# Altium schematic sheet PX4FMUv2.4.6_7.SchDoc: PX4FMUv2.4.6
size 282 x 200 mm; Date: 2020/2/15 15:44:31; SheetNumber: 8; GateName_1: G$1; SymbolName_1: A4L-LOC; LibraryName: pixhawk2; DeviceSetName: A4L-LOC
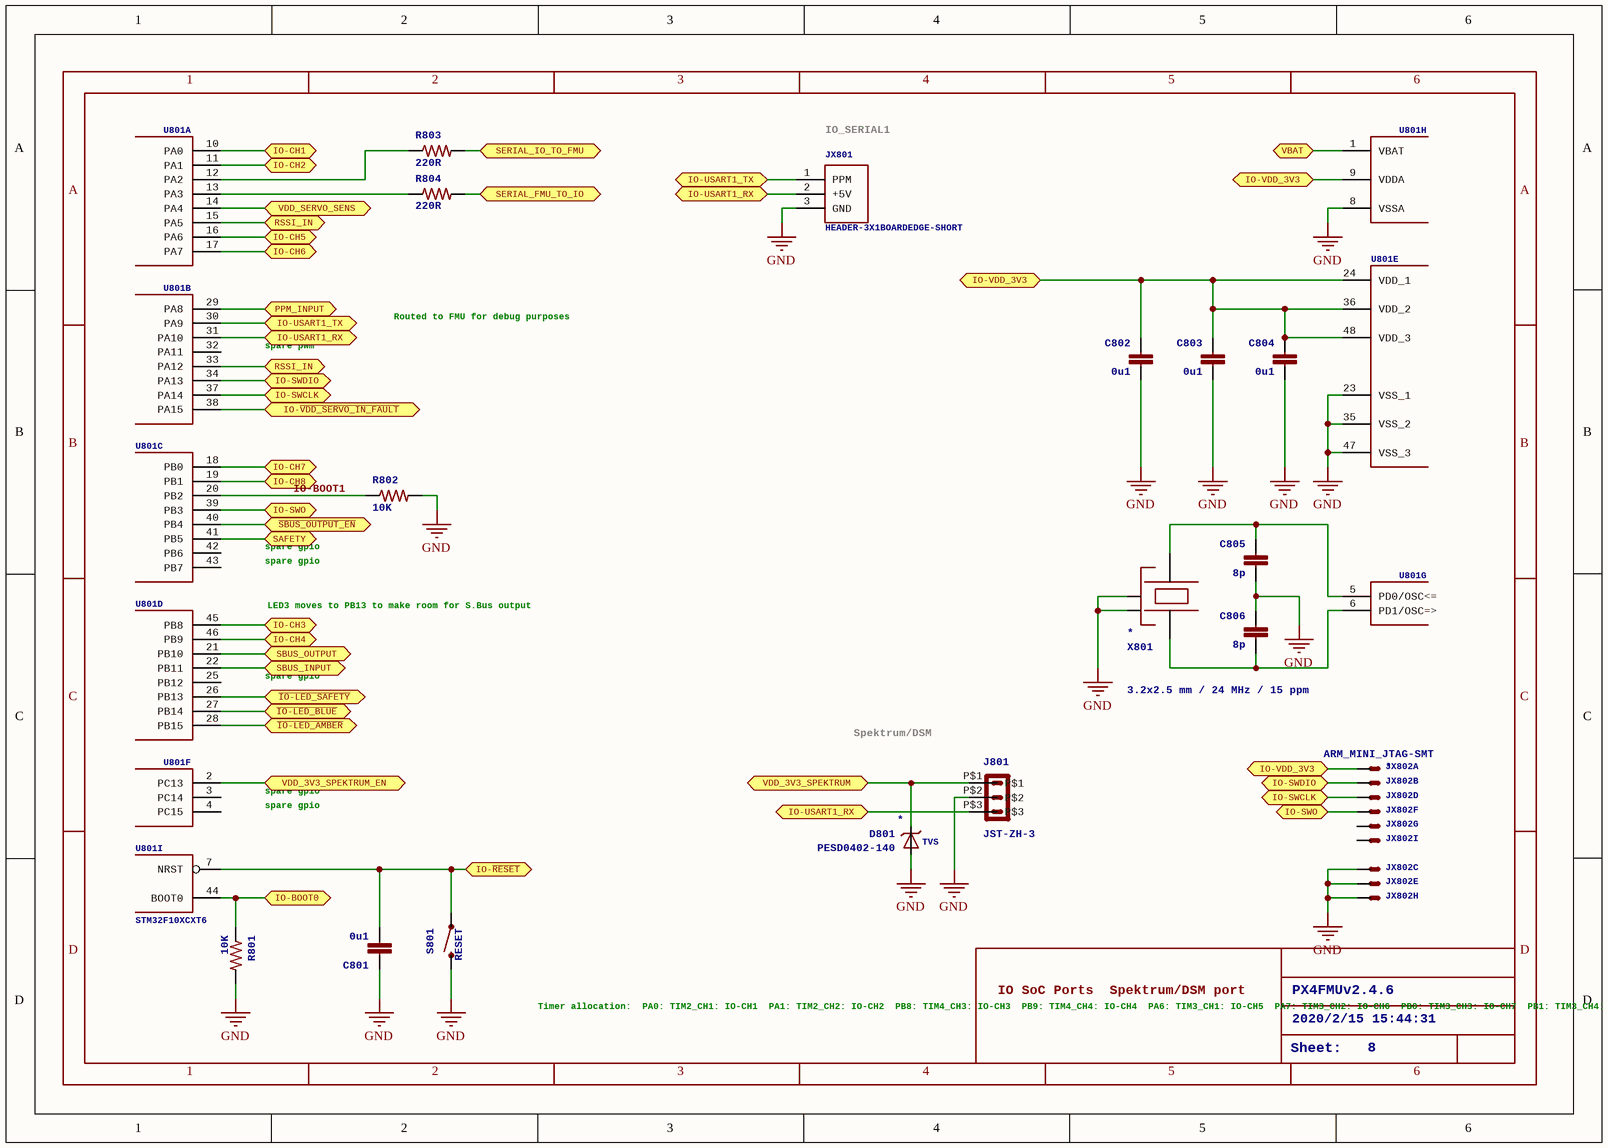
[diagram p0: PX4FMUv2.4.6_7.SchDoc]

## Parts
C801  0u1  [0402-CAP]
C802  0u1  [0402-CAP]
C803  0u1  [0402-CAP]
C804  0u1  [0402-CAP]
C805  8p  [0402-CAP]
C806  8p  [0402-CAP]
D801  PESD0402-140  [0402-TVS]
J801  JST-ZH-3  [JST-ZH-SMT-VERTICAL]
JX801  HEADER-3X1BOARDEDGE-SHORT  [HEADER_3X01_SMD_H_BOARD_EDGE_SHORT]
JX802  ARM_MINI_JTAG-SMT  [FTSH-105-01-XXX-DV-K]  (parts A,B,C,D,E,F,G,H,I of 9)
R801  10K  [0402-RES]
R802  10K  [0402-RES]
R803  220R  [0402-RES]
R804  220R  [0402-RES]
S801  RESET  [EVQP7J01K]
U801  STM32F10XCXT6  [TQFP48]  (value not drawn)  (parts A,B,C,D,E,F,G,H,I of 9)
X801  3.2x2.5 mm / 24 MHz / 15 ppm  [OSCILLATOR-3.2X2.5]

## Ports
IO-BOOT0, IO-CH1, IO-CH2, IO-CH3, IO-CH4, IO-CH5, IO-CH6, IO-CH7, IO-CH8, IO-SWCLK, IO-SWDIO, IO-SWO, IO-USART1_RX, IO-USART1_TX, IO-VDD_3V3, IO-~{RESET}, IO-~{VDD_SERVO_IN_FAULT}, PPM_INPUT, RSSI_IN, SAFETY, SBUS_INPUT, SBUS_OUTPUT, SERIAL_FMU_TO_IO, SERIAL_IO_TO_FMU, VBAT, VDD_3V3_SPEKTRUM, VDD_3V3_SPEKTRUM_EN, VDD_SERVO_SENS, ~{IO-LED_AMBER}, ~{IO-LED_BLUE}, ~{IO-LED_SAFETY}, ~{SBUS_OUTPUT_EN}

## Nets
GND: C801.P$1 C802.P$2 C803.P$2 C804.P$2 C805.P$2 C806.P$1 D801.A J801.P$2 JX801.3(GND) JX802.3(S) JX802.5(S) JX802.9(S) R801.P$2 R802.P$2 S801.B3 U801.8(VSSA) U801.23(VSS_1) U801.35(VSS_2) U801.47(VSS_3) X801.2(NC_2) X801.4(NC_4)
~{IO-LED_AMBER}: U801.28(PB15) ; port ~{IO-LED_AMBER}
~{IO-LED_BLUE}: U801.27(PB14) ; port ~{IO-LED_BLUE}
~{IO-LED_SAFETY}: U801.26(PB13) ; port ~{IO-LED_SAFETY}
IO-BOOT0: R801.P$1 U801.44(BOOT0) ; port IO-BOOT0
IO-BOOT1: R802.P$1 U801.20(PB2)
IO-CH1: U801.10(PA0) ; port IO-CH1
IO-CH2: U801.11(PA1) ; port IO-CH2
IO-CH3: U801.45(PB8) ; port IO-CH3
IO-CH4: U801.46(PB9) ; port IO-CH4
IO-CH5: U801.16(PA6) ; port IO-CH5
IO-CH6: U801.17(PA7) ; port IO-CH6
IO-CH7: U801.18(PB0) ; port IO-CH7
IO-CH8: U801.19(PB1) ; port IO-CH8
IO-~{RESET}: C801.P$2 S801.A1 U801.7(NRST) ; port IO-~{RESET}
IO-SWCLK: JX802.4(S) U801.37(PA14) ; port IO-SWCLK
IO-SWDIO: JX802.2(S) U801.34(PA13) ; port IO-SWDIO
IO-SWO: JX802.6(S) U801.39(PB3) ; port IO-SWO
IO-USART1_RX: J801.P$3 JX801.2(+5V) U801.31(PA10) ; port IO-USART1_RX
IO-USART1_TX: JX801.1(PPM) U801.30(PA9) ; port IO-USART1_TX
IO-~{VDD_SERVO_IN_FAULT}: U801.38(PA15) ; port IO-~{VDD_SERVO_IN_FAULT}
IO-VDD_3V3: C802.P$1 C803.P$1 C804.P$1 JX802.1(S) U801.9(VDDA) U801.24(VDD_1) U801.36(VDD_2) U801.48(VDD_3) ; port IO-VDD_3V3
PPM_INPUT: U801.29(PA8) ; port PPM_INPUT
RSSI_IN: U801.15(PA5) U801.33(PA12) ; port RSSI_IN
~{SBUS_OUTPUT_EN}: U801.40(PB4) ; port ~{SBUS_OUTPUT_EN}
SAFETY: U801.41(PB5) ; port SAFETY
SBUS_INPUT: U801.22(PB11) ; port SBUS_INPUT
SBUS_OUTPUT: U801.21(PB10) ; port SBUS_OUTPUT
SERIAL_FMU_TO_IO: R804.P$2 ; port SERIAL_FMU_TO_IO
SERIAL_IO_TO_FMU: R803.P$2 ; port SERIAL_IO_TO_FMU
VBAT: U801.1(VBAT) ; port VBAT
VDD_3V3_SPEKTRUM: D801.C J801.P$1 ; port VDD_3V3_SPEKTRUM
VDD_3V3_SPEKTRUM_EN: U801.2(PC13) ; port VDD_3V3_SPEKTRUM_EN
VDD_SERVO_SENS: U801.14(PA4) ; port VDD_SERVO_SENS
NetC805_P$1: C805.P$1 U801.5(PD0/OSC<=) X801.3
NetC806_P$2: C806.P$2 U801.6(PD1/OSC=>) X801.1
NetR803_P$1: R803.P$1 U801.12(PA2)
NetR804_P$1: R804.P$1 U801.13(PA3)

Not connected (* = marked no-connect by the designer): JX802 8(S) 10(S); U801 3(PC14) 4(PC15) 25(PB12) 32(PA11) 42(PB6) 43(PB7)

## Notes on the sheet
- (near JX801) IO_SERIAL1
- spare pwm
- Routed to FMU for debug purposes
- spare gpio
- LED3 moves to PB13 to make room for S.Bus output
- Spektrum/DSM
- Timer allocation:
  PA0: TIM2_CH1: IO-CH1
  PA1: TIM2_CH2: IO-CH2
  PB8: TIM4_CH3: IO-CH3
  PB9: TIM4_CH4: IO-CH4
  PA6: TIM3_CH1: IO-CH5
  PA7: TIM3_CH2: IO-CH6
  PB0: TIM3_CH3: IO-CH7
  PB1: TIM3_CH4: IO-CH8
  PA8: TIM1_CH1: PPM_IN
  PA11: TIM1_CH4: RSSI_IN
- IO SoC Ports
  Spektrum/DSM port
- PX4FMUv2.4.6
- 2020/2/15 15:44:31
- Sheet:
- 8
- 1
- 2
- 3
- 4
- 5
- 6
- A
- B
- C
- D

## Library data of the parts
C801-C804 = CAP0402: CapacitorStandard 0603 ceramic capacitor, and 0.1" leaded capacitor.; PARTNO: CC0402ZRY5V7BB104; GateName_1: G$1; SymbolName_1: CAP; DeviceName: 0402; LibraryName: pixhawk2; DeviceSetName: CAP
C805 C806 = CAP0402: CapacitorStandard 0603 ceramic capacitor, and 0.1" leaded capacitor.; PARTNO: C1005C0G1H080C; GateName_1: G$1; SymbolName_1: CAP; DeviceName: 0402; LibraryName: pixhawk2; DeviceSetName: CAP
D801 = DIODE-TVS: GateName_1: G$1; SymbolName_1: DIODE-TVS; LibraryName: pixhawk2; DeviceSetName: DIODE-TVS; NAME: *; PARTNO: PESD0402-140; TVS: TVS
J801 = JST-ZH-3: PARTNO: B3B-ZR-SM4-TF (LF)(SN)(P); GateName_1: G$1; SymbolName_1: JST-ZH-3; LibraryName: for-transfers; DeviceSetName: JST-ZH-3
JX801 = HEADER-3X1BOARDEDGE-SHORT: Single row 0.1" servo header; GateName_1: G$1; SymbolName_1: SERVO1; BOM: EXCLUDE; DeviceName: BOARDEDGE-SHORT; LibraryName: pixhawk2; DeviceSetName: HEADER-3X1
JX802 = ARM_MINI_JTAG-SMT: CONNECTORwire to board 1.25 mm (.049 inch) pitch header; PARTNO: M50-3900542; GateName_1: -VTREF; SymbolName_1: MV; GateName_2: -TMS/SWDIO; SymbolName_2: M; GateName_3: -GND1; GateName_4: -TCK/SWCLK; GateName_5: -GND2; GateName_6: -TDO/SWO; GateName_7: -TDI/EXTB; GateName_8: -GND3; GateName_9: -!RESET; DeviceName: -SMT; BOM: EXCLUDE; SymbolName_3: M; SymbolName_4: M; SymbolName_5: M; SymbolName_6: M; SymbolName_7: M; SymbolName_8: M; SymbolName_9: M; LibraryName: pixhawk2; DeviceSetName: ARM_MINI_JTAG; NAME: *
R801 R802 = RESISTOR0402-RES: ResistorBasic schematic elements and footprints for 0603, 1206, and PTH 1/10th watt (small) resistors.; PARTNO: RC0402FR-0710KL; GateName_1: G$1; SymbolName_1: RESISTOR; DeviceName: 0402-RES; LibraryName: pixhawk2; DeviceSetName: RESISTOR
R803 R804 = RESISTOR0402-RES: ResistorBasic schematic elements and footprints for 0603, 1206, and PTH 1/10th watt (small) resistors.; PARTNO: RC0402FR-07220RL; GateName_1: G$1; SymbolName_1: RESISTOR; DeviceName: 0402-RES; LibraryName: pixhawk2; DeviceSetName: RESISTOR
S801 = SWITCH-MOMENTARY-2: PARTNO: EVQ-P7J01P; GateName_1: G$1; SymbolName_1: SWITCH-MOMENTARY-2; LibraryName: pixhawk2; DeviceSetName: SWITCH-MOMENTARY-2
U801 = STM32F10XCXT6: ST STM32F101/103 48pin LQFP; PARTNO: STM32F100C8T6B; GateName_1: PORTA_L; SymbolName_1: PORT_A_L-1; GateName_2: PORTA_H; SymbolName_2: PORT_A_H-1; GateName_3: PORTB_L; SymbolName_3: PORT_B_L-1; GateName_4: PORTB_H; SymbolName_4: PORT_B_H-1; GateName_5: POWER; SymbolName_5: VCC_VDD_S; GateName_6: PORTC; SymbolName_6: PORT_C_3; GateName_7: PORTD/OSC; SymbolName_7: PORT_D_2; GateName_8: AN_POWER; SymbolName_8: BAT_AN_M-1; GateName_9: RESET; SymbolName_9: BOOT_RST-1; LibraryName: pixhawk2; DeviceSetName: STM32F10XCXT6
X801 = OSCILLATOR-3.2X2.5: Crystal Oscillator in 3.2x2.5 SMD; PARTNO: NX3225SA-24.000000MHZ; GateName_1: G$1; SymbolName_1: XTAL; DeviceName: -3.2X2.5; LibraryName: pixhawk2; DeviceSetName: OSCILLATOR; NAME: *